# Altium schematic sheet AD9954模块.SchDoc
size A4
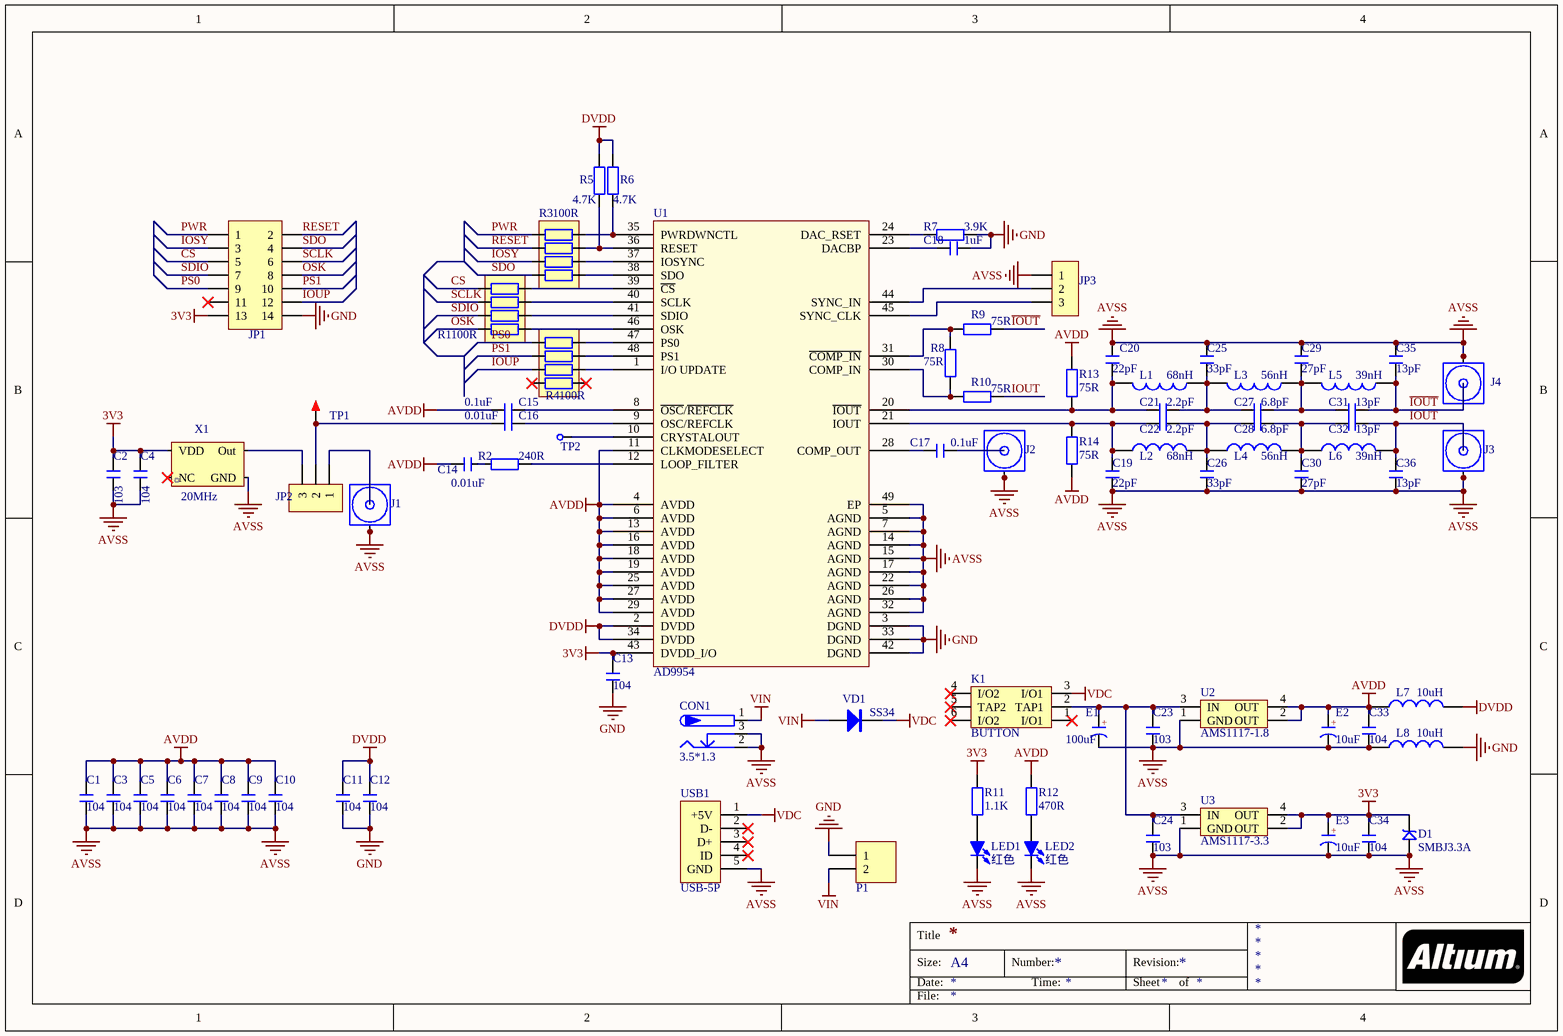
[diagram p0: AD9954模块.SchDoc]

## Parts
C1  104  [C 0603]
C2  103  [C 0603]
C3  104  [C 0603]
C4  104  [C 0603]
C5  104  [C 0603]
C6  104  [C 0603]
C7  104  [C 0603]
C8  104  [C 0603]
C9  104  [C 0603]
C10  104  [C 0603]
C11  104  [C 0603]
C12  104  [C 0603]
C13  104  [C 0603]
C14  0.01uF  [C 0603]
C15  0.1uF  [C 0603]
C16  0.01uF  [C 0603]
C17  0.1uF  [C 0603]
C18  1uF  [C 0603]
C19  22pF  [C 0603]
C20  22pF  [C 0603]
C21  2.2pF  [C 0603]
C22  2.2pF  [C 0603]
C23  103  [C 0603]
C24  103  [C 0603]
C25  33pF  [C 0603]
C26  33pF  [C 0603]
C27  6.8pF  [C 0603]
C28  6.8pF  [C 0603]
C29  27pF  [C 0603]
C30  27pF  [C 0603]
C31  13pF  [C 0603]
C32  13pF  [C 0603]
C33  104  [C 0603]
C34  104  [C 0603]
C35  13pF  [C 0603]
C36  13pF  [C 0603]
CON1  3.5*1.3  [DC-005]
D1  SMBJ3.3A  [SMB]
E1  100uF  [CD B(3528)]
E2  10uF  [CD B(3528)]
E3  10uF  [CD B(3528)]
J1  COAX  [MCX5.08-5]  (value not drawn)
J2  COAX  [MCX5.08-5-H]  (value not drawn)
J3  COAX  [MCX5.08-5-H]  (value not drawn)
J4  COAX  [MCX5.08-5-H]  (value not drawn)
JP1  Header 2X7  [HDR-7X2]  (value not drawn)
JP2  HDR-1X3  [HDR-1X3]  (value not drawn)
JP3  HDR-1X3  [HDR-1X3]  (value not drawn)
K1  BUTTON  [KFT DIP-8X8]
L1  68nH  [L 0603]
L2  68nH  [L 0603]
L3  56nH  [L 0603]
L4  56nH  [L 0603]
L5  39nH  [L 0603]
L6  39nH  [L 0603]
L7  10uH  [L 0805]
L8  10uH  [L 0805]
LED1  红色  [LED 0805G]
LED2  红色  [LED 0805G]
P1  Header 2  [HDR2X1_B2]  (value not drawn)
R1  100R  [RCA-8P4R-0603]
R2  240R  [R 0603]
R3  100R  [RCA-8P4R-0603]
R4  100R  [RCA-8P4R-0603]
R5  4.7K  [R 0603]
R6  4.7K  [R 0603]
R7  3.9K  [R 0603]
R8  75R  [R 0603]
R9  75R  [R 0603]
R10  75R  [R 0603]
R11  1.1K  [R 0603]
R12  470R  [R 0603]
R13  75R  [R 0603]
R14  75R  [R 0603]
TP1  TEST TP  [TEST TP1.4_B]  (value not drawn)
TP2  CHECK  [CHECK-C]  (value not drawn)
U1  AD9954  [SV_48_4]
U2  AMS1117-1.8  [SOT223_N]
U3  AMS1117-3.3  [SOT223_N]
USB1  USB-5P  [USB-MICRO_B]
VD1  SS34  [DIODE-SMA]
X1  Frequency: 20MHz  [X-CPX75]  (hidden comment: XTAL)

## Nets
3V3: C2.2 C4.2 C13.2 C34.2 D1.2 E3.1(A) JP1.13 R11.2 U1.43(DVDD_I/O) U3.2(OUT) U3.4(OUT) X1.4(VDD)
AVDD: C1.2 C3.2 C5.2 C6.2 C7.2 C8.2 C9.2 C10.2 C14.1 C15.1 C33.2 E2.1(A) L7.1 R12.2 R13.2 R14.1 U1.4(AVDD) U1.6(AVDD) U1.11(CLKMODESELECT) U1.13(AVDD) U1.16(AVDD) U1.18(AVDD) U1.19(AVDD) U1.25(AVDD) U1.27(AVDD) U1.29(AVDD) U2.2(OUT) U2.4(OUT)
AVSS: C1.1 C2.1 C3.1 C4.1 C5.1 C6.1 C7.1 C8.1 C9.1 C10.1 C19.2 C20.2 C23.1 C24.1 C25.2 C26.2 C29.2 C30.2 C33.1 C34.1 C35.2 C36.2 CON1.2 CON1.3 D1.1 E1.2(K) E2.2(K) E3.2(K) J1.2(GND) J1.3(GND) J1.4(GND) J1.5(GND) J2.2(GND) J2.3(GND) J2.4(GND) J2.5(GND) J3.2(GND) J3.3(GND) J3.4(GND) J3.5(GND) J4.2(GND) J4.3(GND) J4.4(GND) J4.5(GND) JP3.1 L8.1 LED1.2(K) LED2.2(K) U1.5(AGND) U1.7(AGND) U1.14(AGND) U1.15(AGND) U1.17(AGND) U1.22(AGND) U1.26(AGND) U1.32(AGND) U1.49(EP) U2.1(GND) U3.1(GND) USB1.5(GND) X1.2(GND)
DVDD: C11.2 C12.2 L7.2 R5.2 R6.2 U1.2(DVDD) U1.34(DVDD)
GND: C11.1 C12.1 C13.1 C18.2 JP1.14 L8.2 P1.1 R7.2 U1.3(DGND) U1.33(DGND) U1.42(DGND)
VDC: K1.3(I/O1) USB1.1(+5V) VD1.2(K)
VIN: CON1.1 P1.2 VD1.1(A)
CS: JP1.5 R1.1
~{IOUT}: C31.2 C35.1 J4.1(Signal) L5.1 R9.1
IOSY: JP1.3 R3.3
IOUP: JP1.12 R4.3
IOUT: C32.1 C36.1 J3.1(Signal) L6.2 R10.1
OSK: JP1.8 R1.4
PS0: JP1.9 R4.1
PS1: JP1.10 R4.2
PWR: JP1.1 R3.1
RESET: JP1.2 R3.2
SCLK: JP1.6 R1.2
SDIO: JP1.7 R1.3
SDO: JP1.4 R3.4
NetC14_2: C14.2 R2.1
NetC15_2: C15.2 U1.8(~{OSC}/~{REFCLK})
NetC16_1: C16.1 JP2.2 TP1.1
NetC16_2: C16.2 U1.9(OSC/REFCLK)
NetC17_1: C17.1 U1.28(COMP_OUT)
NetC17_2: C17.2 J2.1(Signal)
NetC18_1: C18.1 U1.23(DACBP)
NetC19_1: C19.1 C22.2 L2.1 R14.2 U1.21(IOUT)
NetC20_1: C20.1 C21.1 L1.2 R13.1 U1.20(~{IOUT})
NetC21_2: C21.2 C25.1 C27.1 L1.1 L3.2
NetC22_1: C22.1 C26.1 C28.2 L2.2 L4.1
NetC23_2: C23.2 C24.2 E1.1(A) K1.2(TAP1) U2.3(IN) U3.3(IN)
NetC27_2: C27.2 C29.1 C31.1 L3.1 L5.2
NetC28_1: C28.1 C30.1 C32.2 L4.2 L6.1
NetJ1_1: J1.1(Signal) JP2.1
NetJP2_3: JP2.3 X1.3(Out)
NetJP3_2: JP3.2 U1.44(SYNC_IN)
NetJP3_3: JP3.3 U1.45(SYNC_CLK)
NetLED1_1: LED1.1(A) R11.1
NetLED2_1: LED2.1(A) R12.1
NetR1_5: R1.5 U1.46(OSK)
NetR1_6: R1.6 U1.41(SDIO)
NetR1_7: R1.7 U1.40(SCLK)
NetR1_8: R1.8 U1.39(~{CS})
NetR2_2: R2.2 U1.12(LOOP_FILTER)
NetR3_5: R3.5 U1.38(SDO)
NetR3_6: R3.6 U1.37(IOSYNC)
NetR3_7: R3.7 R5.1 U1.36(RESET)
NetR3_8: R3.8 R6.1 U1.35(PWRDWNCTL)
NetR4_6: R4.6 U1.1(I/O_UPDATE)
NetR4_7: R4.7 U1.48(PS1)
NetR4_8: R4.8 U1.47(PS0)
NetR7_1: R7.1 U1.24(DAC_RSET)
NetR8_1: R8.1 R10.2 U1.30(COMP_IN)
NetR8_2: R8.2 R9.2 U1.31(~{COMP_IN})
NetTP2_1: TP2.1 U1.10(CRYSTALOUT)

Not connected (* = marked no-connect by the designer): JP1 11*; K1 1(I/O1)* 4(I/O2)* 5(TAP2)* 6(I/O2)*; R4 4* 5*; USB1 2(D-)* 3(D+)* 4(ID)*; X1 1(NC)*

## Notes on the sheet
- Title
- Size:
- Date:
- A4
- Number:
- Time:
- Revision:
- Sheet
- of
- File:
- (in symbol C-CD) +

## Library data of the parts
C1-C36 = C: 无极性贴片电容; 版权归属: 源创客; BOM名称: 无极性贴片电容; 学习资源: www.ooocke.com
CON1 = P-DC: 低压电源接口; BOM名称: DC电源接口; 版权归属: 源创客; 学习资源: www.ooocke.com
D1 = SMBJ: TVS
E1-E3 = C-CD: 贴片钽电容; 版权归属: 源创客; BOM名称: 贴片钽电容; 学习资源: www.ooocke.com
JP1 = Header 7X2: 7*2P接插件; 版权归属: 源创客; BOM名称: 7*2P接插件; 学习资源: www.ooocke.com
JP2 JP3 = Header 3: 3P接插件; 版权归属: 源创客; BOM名称: 3P接插件; 学习资源: www.ooocke.com
L1-L8 = L: 小功率贴片电感; 版权归属: 源创客; BOM名称: 小功率贴片电感; 学习资源: www.ooocke.com
LED1 LED2 = LED-SMD: 贴片LED; 版权归属: 源创客; BOM名称: 贴片LED; 学习资源: www.ooocke.com
P1 = Header 2: 接插件; LatestRevisionDate: 17-Jul-2002; LatestRevisionNote: Re-released for DXP Platform.; Publisher: Altium Limited
R1 R3 R4 = R-8P4R: 贴片网络排阻; 版权归属: 源创客; BOM名称: 贴片网络排阻; 学习资源: www.ooocke.com
R2 R5-R14 = R: 贴片电阻; 版权归属: 源创客; BOM名称: 贴片电阻; 学习资源: www.ooocke.com
TP1 = TEST TP: 测试环; 版权归属: 源创客; BOM名称: 测试环; 学习资源: www.ooocke.com
TP2 = CHECK: 测试点
U1 = AD9954YSVZ: 400MSPS、14位、1.8V CMOS、直接数字频率合成器; Manufacturer_Part_Number: AD9954YSVZ; Vendor: Vendor; Value: Value; Type: Type; RefDes: Refdes
U2 U3 = AMS1117
USB1 = USB-5P: 微型USB母座; 版权归属: 源创客; BOM名称: 微型USB母座; 学习资源: www.ooocke.com
VD1 = SS34: 肖特基二极管; 版权归属: 源创客; 属性: 40V/3A; BOM名称: 肖特基二极管; 学习资源: www.ooocke.com
X1 = XTAL_Oscillator: 有源晶振